# EAGLE schematic ESP8266ServoGPIOServerAP (EAGLE 8.1.0)
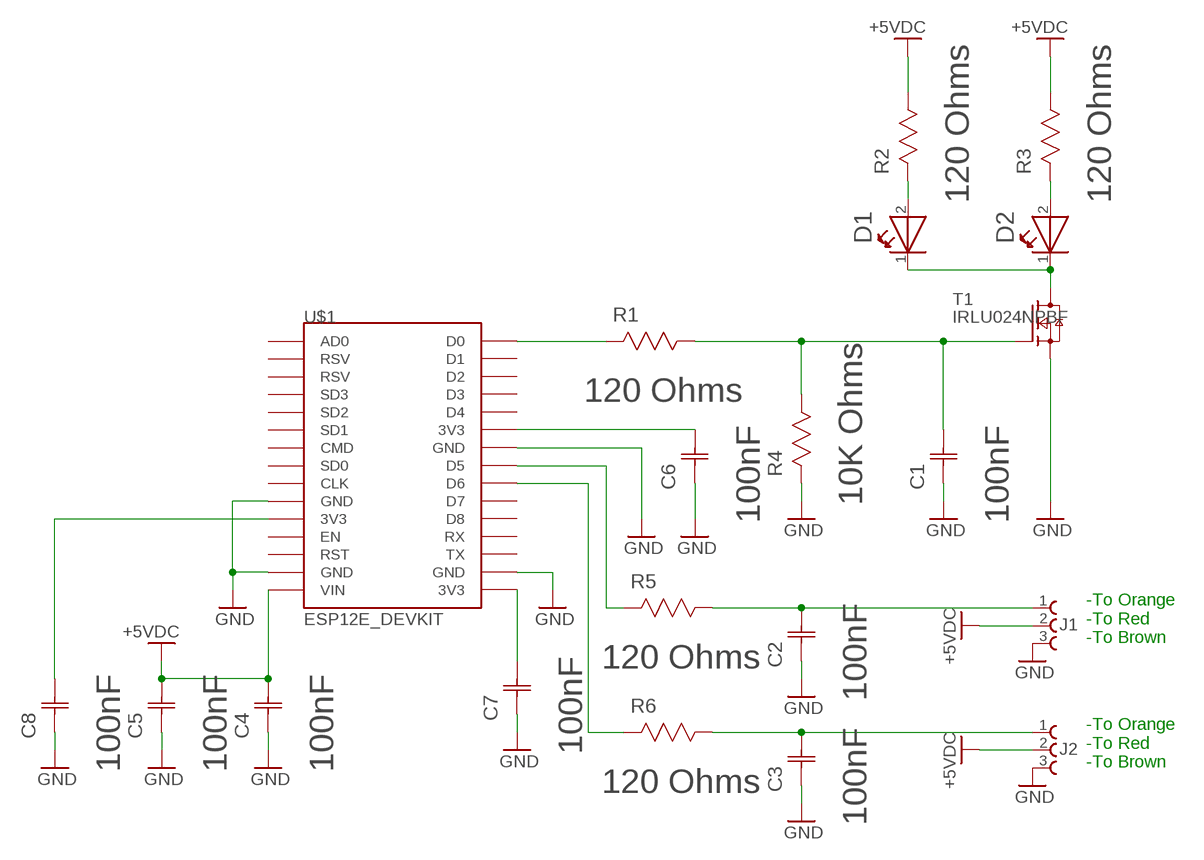
[diagram p0: schematic, sheet 1]

## Parts
C1  100nF  GRM21BR60J226ME39L  [CAPC2013X135N]
C2  100nF  GRM21BR60J226ME39L  [CAPC2013X135N]
C3  100nF  GRM21BR60J226ME39L  [CAPC2013X135N]
C4  100nF  GRM21BR60J226ME39L  [CAPC2013X135N]
C5  100nF  GRM21BR60J226ME39L  [CAPC2013X135N]
C6  100nF  GRM21BR60J226ME39L  [CAPC2013X135N]
C7  100nF  GRM21BR60J226ME39L  [CAPC2013X135N]
C8  100nF  GRM21BR60J226ME39L  [CAPC2013X135N]
D1  WL-SMTW-150141AS73100-A  [3528-2PIN]
D2  WL-SMTW-150141AS73100-A  [3528-2PIN]
J1  61300311121  [61300311121]
J2  61300311121  [61300311121]
R1  120 Ohms  LR1206-R05FI  [RESC3216X71N]
R2  120 Ohms  LR1206-R05FI  [RESC3216X71N]
R3  120 Ohms  LR1206-R05FI  [RESC3216X71N]
R4  10K Ohms  LR1206-R05FI  [RESC3216X71N]
R5  120 Ohms  LR1206-R05FI  [RESC3216X71N]
R6  120 Ohms  LR1206-R05FI  [RESC3216X71N]
T1  IRLU024NPBF  2N7002E  [SOT23]
U$1  ESP12E_DEVKIT  [ESP12E_DEVKIT]

## Nets
GND: C1.1(C1) C2.1(C1) C3.1(C1) C4.1(C1) C4.2(C2) C5.1(C1) C5.2(C2) C6.1(C1) C7.1(C1) C8.1(C1) J1.2 J1.3 J2.2 J2.3 R2.1(R1) R3.1(R1) R4.2(R2) T1.2(S) U$1.GND@0(GND) U$1.GND@1(GND) U$1.GND@2(GND) U$1.GND@3(GND) U$1.VIN ; supply symbol labelled +5VDC
N$1: C1.2(C2) R1.1(R1) R4.1(R1) T1.1(G)
N$2: R1.2(R2) U$1.D0
N$3: D1.1(K) D2.1(K) T1.3(D)
N$4: D1.2(A) R2.2(R2)
N$5: D2.2(A) R3.2(R2)
N$6: R5.2(R2) U$1.D5
N$7: R6.2(R2) U$1.D6
N$8: C2.2(C2) J1.1 R5.1(R1)
N$9: C3.2(C2) J2.1 R6.1(R1)
N$10: C8.2(C2) U$1.3V3@0(3V3)
N$11: C6.2(C2) U$1.3V3@1(3V3)
N$12: C7.2(C2) U$1.3V3@2(3V3)
Unconnected: U$1.AD0 U$1.CLK U$1.CMD U$1.D1 U$1.D2 U$1.D3 U$1.D4 U$1.D7 U$1.D8 U$1.EN U$1.RST U$1.RSV@0(RSV) U$1.RSV@1(RSV) U$1.RX U$1.SD0 U$1.SD1 U$1.SD2 U$1.SD3 U$1.TX

## Notes on the sheet
- -To Orange
  -To Red
  -To Brown
- -To Orange
  -To Red
  -To Brown

## Library data of the parts
C1-C8 = Murata_By_element14_Batch_1:GRM21BR60J226ME39L: CAPACITOR, 0805; MPN: GRM21BR60J226ME39L; OC_FARNELL: 1735531; OC_NEWARK: 24R6338; SUPPLIER: Murata; TOLERANCE: ±20%; VALUE: 22uF; VOLTAGERATING: 6.3V
D1 D2 = Wurth_Elektronik_Optoelectronics_rev15c:WL-SMTW: SMD TOP LED mono-color waterclear Characteristics Low energy consumption High reliability Low current requirement Fast switching No UV/IR radiation Slim Miniature size Flexibility in design Top view Applications Portable computers boards Signage and indirect illumination Flat lamp Indicator and backlight in automotive, telecommunication Consumer application: dash-board, telephone or A/V equipments Flat backlight for LCDs, switches and symbols Optical indicators Indoor and outdoor displays Scanner General lighting <http://katalog.we-online.de/media/images/v2/Family_WL-SMTW_1411.jpg> Details see: http://katalog.we-online.de/en/led/WL-SMTW?m Updated: 2015-12-21 2015 (C) Wurth Elektronik; COMPANY-URL: http://www.we-online.de; CREATED-BY: Christin Otto; CREATED-DATE: APR 2013; DATASHEET-URL: http://katalog.we-online.de/en/led/WL-SMTW?m=t&sq=smtw&sp=&sp=http%3A%2F%2Fwww.we-online.de%2Fweb%2Fen%2Felectronic_components%2Fsearchpage_PBS.php%3Fsearch%3Dsmtw; MANUFACTURER: Würth Elektronik eiSos GmbH
J1 J2 = Wurth_Elektronik_Electromechanic_Board_to_Board_Connectors_rev16a:61300311121: WR-PHD 5.54mm Pin Header, 3 Pin =>Code : Con_BTB_PHD_2.54_1_THT_61300311121 <http://katalog.we-online.de/media/images/eican/Con_BTB_PHD_2.54_1_THT_6130xx11121_pf2.jpg> Details see: http://katalog.we-online.de/en/em/613_0xx_111_21 Created 2014-05-29, Karrer Zheng 2014 (C) Würth Elektronik
R1-R6 = Welwyn_By_element14_Batch_1:LR1206-R05FI: RESISTOR, 1206; MPN: LR1206-R05FI; OC_FARNELL: 1099913; OC_NEWARK: 97K3860; SUPPLIER: Welwyn; TOLERANCE: ±1%; VALUE: 0.05 Ohms; WATTAGE: 0.5W
T1 = nxp_60_1_1:2N7002: N-channel TrenchMOS FET N-channel enhancement mode Field-Effect Transistor (FET) in a plastic package using TrenchMOS technology. AAL Eindhoven MK
U$1 = ESP12E_DEVKIT:ESP12E_DEVKIT: ESP12E DEVKIT BOARD